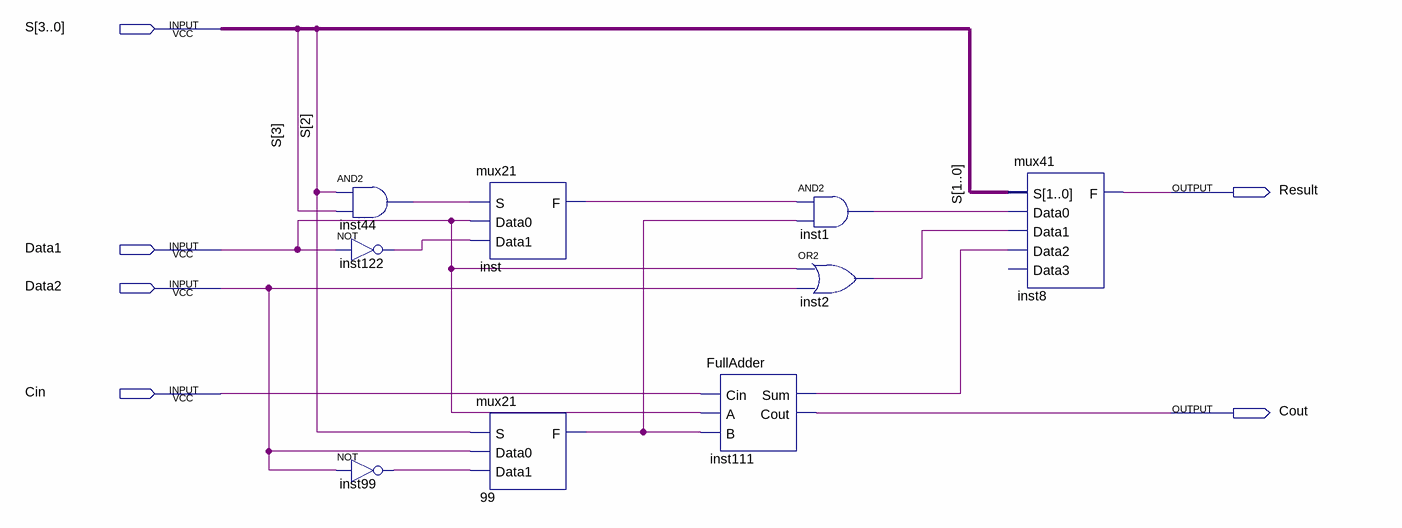
[diagram p0: schematic sheet]
// Quartus schematic bit_slice.bdf as structural Verilog: 9 symbols, 6 pins
module bit_slice (
  input  [3:0] S,
  input  Data1,
  input  Data2,
  input  Cin,
  output Result,
  output Cout
);

  wire inst1_out, inst2_out, inst44_out, inst99_out, inst111_sum, inst122_out, inst_f, n99_f;

  and inst44 (inst44_out, S[2], S[3]);
  not inst122 (inst122_out, Data1);
  not inst99 (inst99_out, Data2);
  mux21 inst (.S(inst44_out), .Data0(Data1), .Data1(inst122_out), .F(inst_f));
  mux21 u_99 (.S(S[2]), .Data0(Data2), .Data1(inst99_out), .F(n99_f));
  FullAdder inst111 (.Cin(Cin), .A(Data1), .B(n99_f), .Sum(inst111_sum), .Cout(Cout));
  and inst1 (inst1_out, inst_f, n99_f);
  or inst2 (inst2_out, Data1, Data2);
  mux41 inst8 (.S(S[1:0]), .Data0(inst1_out), .Data1(inst2_out), .Data2(inst111_sum), .F(Result));  // open: Data3
endmodule
